# Altium schematic sheet 04_daisy-chain_isolation.SchDoc: foxBMS BMS-Interface
size A3; DocumentNumber: 4; SheetNumber: 4; SheetTotal: 6; Author: Fraunhofer IISB foxBMS Team; REL-DATE: 2017-05-09; VERSION: 1.1.0; GateName_1: G$1; SymbolName_1: FRAME_B_L; LibraryName: foxBMS_BMS-Master_V1.00_A; DeviceSetName: FRAME_B_L; GateName_2: G$2; SymbolName_2: DOCFIELD; SheetDescription: Daisy Chain Isolation
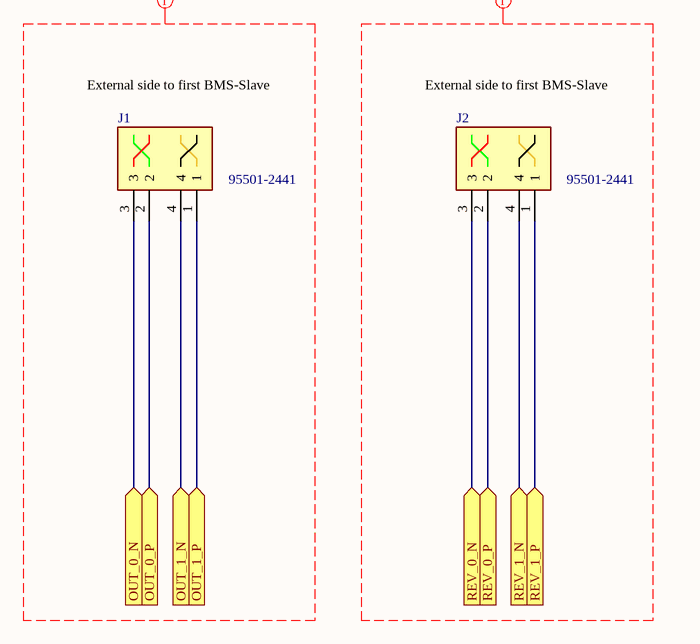
[diagram p0: 04_daisy-chain_isolation.SchDoc]

## Parts
J1  95501-2441  [95501-2441]
J2  95501-2441  [95501-2441]

## Ports
OUT_0_N (in), OUT_0_P (in), OUT_1_N (in), OUT_1_P (in), REV_0_N (in), REV_0_P (in), REV_1_N (in), REV_1_P (in)

## Nets
OUT_0_N: J1.3 ; port OUT_0_N
OUT_0_P: J1.2 ; port OUT_0_P
OUT_1_N: J1.4 ; port OUT_1_N
OUT_1_P: J1.1 ; port OUT_1_P
REV_0_N: J2.3 ; port REV_0_N
REV_0_P: J2.2 ; port REV_0_P
REV_1_N: J2.4 ; port REV_1_N
REV_1_P: J2.1 ; port REV_1_P

## Layout directives
net class ISO_BAT_UP: (no net found under the mark)
net class ISO_BAT_DOWN: (no net found under the mark)

## Notes on the sheet
- External side to first BMS-Slave
- Fraunhofer IISB
- Schottkystr. 10
- developed by:
- 91058 Erlangen
- Germany
- Author
- Project
- License
- Description
- File
- Version
- Release Date
- Sheet
- www.foxbms.org
- www.iisb.fraunhofer.de
- foxBMS Team
- /

## Library data of the parts
J1 J2 = 95501-2441: Connector; Manufacturer_Name: Molex; Allied_Number: 70372436; Datasheet Link: http://www.molex.com/webdocs/datasheets/pdf/en-us/0955012441_MODULAR_JACKS_PLUG.pdf; Manufacturer_Part_Number: 95501-2441; Mouser Part Number: 538-95501-2441; Mouser Price/Stock: https://www.mouser.com/Search/Refine.aspx?Keyword=538-95501-2441; RS Part Number: 2400913; RS Price/Stock: https://uk.rs-online.com/web/p/products/2400913; Allied Price/Stock: http://www.alliedelec.com/molex-incorporated-95501-2441/70372436/